# Altium schematic sheet Liquid_level.SchDoc
size A
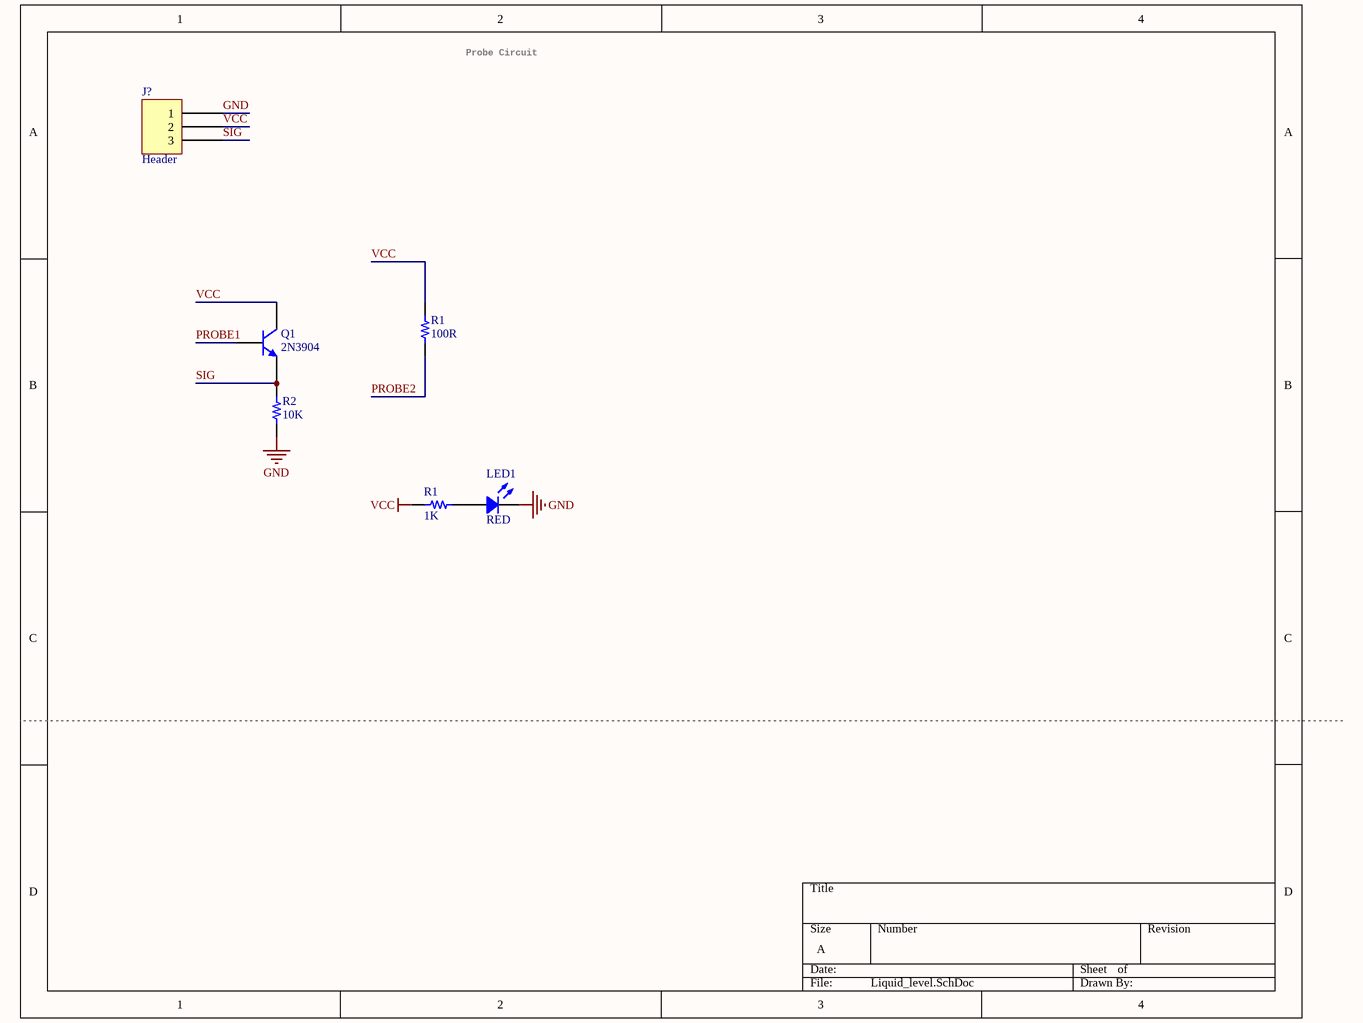
[diagram p0: Liquid_level.SchDoc]

## Parts
(Parts that share a designator on the sheet are numbered #1, #2 ... from top to bottom, then left to right.)
J?  Header  [JST XH B3B-XH-A - RIGHT]
LED1  RED  [LED 0805/2012 RED]
Q1  2N3904  [SOT23]
R1#1  100R  [RES 1206/3216]
R1#2  1K  [RES 1206/3216]
R2  10K  [RES 1206/3216]

## Nets
GND: J?.1 LED1.2 R2.1
VCC: J?.2 Q1.C R1#1.2 R1#2.2
PROBE1: Q1.B
PROBE2: R1#1.1
SIG: J?.3 Q1.E R2.2
NetLED1_1: LED1.1 R1#2.1

## Notes on the sheet
- Probe Circuit

## Library data of the parts
J? = 3 Pin
LED1 = LED: Chip LED; Value: Green
Q1 = 2N2222: NPN; E-mail: picpars@gmail.com; De: Seyed Mohsen Ghasemian; web: www.picpars.com
R1#1 R2 = Resistor: SMT Resistor; Value: 1K
R1#2 = Resistor: SMT Resistor; Value: 1K